# EAGLE design LEDBoard (EAGLE 9.2.2)
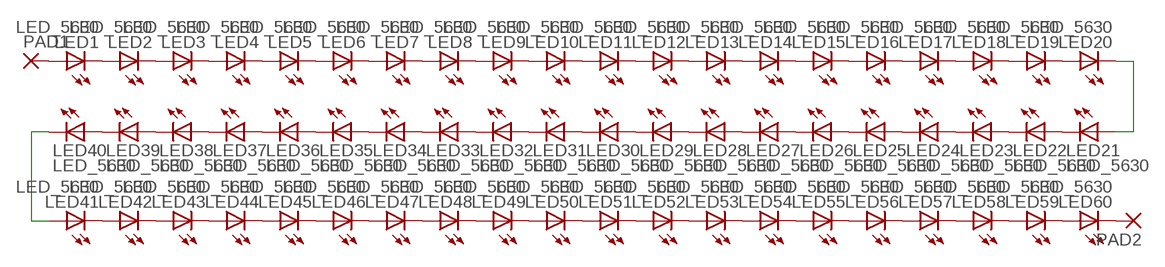
[diagram p0: schematic, sheet 1]

## Parts
LED1  LED_5630  [LED5730]
LED2  LED_5630  [LED5730]
LED3  LED_5630  [LED5730]
LED4  LED_5630  [LED5730]
LED5  LED_5630  [LED5730]
LED6  LED_5630  [LED5730]
LED7  LED_5630  [LED5730]
LED8  LED_5630  [LED5730]
LED9  LED_5630  [LED5730]
LED10  LED_5630  [LED5730]
LED11  LED_5630  [LED5730]
LED12  LED_5630  [LED5730]
LED13  LED_5630  [LED5730]
LED14  LED_5630  [LED5730]
LED15  LED_5630  [LED5730]
LED16  LED_5630  [LED5730]
LED17  LED_5630  [LED5730]
LED18  LED_5630  [LED5730]
LED19  LED_5630  [LED5730]
LED20  LED_5630  [LED5730]
LED21  LED_5630  [LED5730]
LED22  LED_5630  [LED5730]
LED23  LED_5630  [LED5730]
LED24  LED_5630  [LED5730]
LED25  LED_5630  [LED5730]
LED26  LED_5630  [LED5730]
LED27  LED_5630  [LED5730]
LED28  LED_5630  [LED5730]
LED29  LED_5630  [LED5730]
LED30  LED_5630  [LED5730]
LED31  LED_5630  [LED5730]
LED32  LED_5630  [LED5730]
LED33  LED_5630  [LED5730]
LED34  LED_5630  [LED5730]
LED35  LED_5630  [LED5730]
LED36  LED_5630  [LED5730]
LED37  LED_5630  [LED5730]
LED38  LED_5630  [LED5730]
LED39  LED_5630  [LED5730]
LED40  LED_5630  [LED5730]
LED41  LED_5630  [LED5730]
LED42  LED_5630  [LED5730]
LED43  LED_5630  [LED5730]
LED44  LED_5630  [LED5730]
LED45  LED_5630  [LED5730]
LED46  LED_5630  [LED5730]
LED47  LED_5630  [LED5730]
LED48  LED_5630  [LED5730]
LED49  LED_5630  [LED5730]
LED50  LED_5630  [LED5730]
LED51  LED_5630  [LED5730]
LED52  LED_5630  [LED5730]
LED53  LED_5630  [LED5730]
LED54  LED_5630  [LED5730]
LED55  LED_5630  [LED5730]
LED56  LED_5630  [LED5730]
LED57  LED_5630  [LED5730]
LED58  LED_5630  [LED5730]
LED59  LED_5630  [LED5730]
LED60  LED_5630  [LED5730]
PAD1  SMD5  [SMD2,54-5,08]
PAD2  SMD5  [SMD2,54-5,08]

## Nets
N$1: LED1.C LED2.A LED2.A1(A)
N$2: LED3.C LED4.A LED4.A1(A)
N$3: LED2.C LED3.A LED3.A1(A)
N$4: LED5.C LED6.A LED6.A1(A)
N$5: LED7.C LED8.A LED8.A1(A)
N$6: LED6.C LED7.A LED7.A1(A)
N$7: LED4.C LED5.A LED5.A1(A)
N$8: LED9.C LED10.A LED10.A1(A)
N$9: LED11.C LED12.A LED12.A1(A)
N$10: LED10.C LED11.A LED11.A1(A)
N$11: LED13.C LED14.A LED14.A1(A)
N$12: LED15.C LED16.A LED16.A1(A)
N$13: LED14.C LED15.A LED15.A1(A)
N$14: LED12.C LED13.A LED13.A1(A)
N$15: LED8.C LED9.A LED9.A1(A)
N$16: LED17.C LED18.A LED18.A1(A)
N$17: LED19.C LED20.A LED20.A1(A)
N$18: LED18.C LED19.A LED19.A1(A)
N$19: LED16.C LED17.A LED17.A1(A)
N$20: LED21.C LED22.A LED22.A1(A)
N$21: LED23.C LED24.A LED24.A1(A)
N$22: LED22.C LED23.A LED23.A1(A)
N$23: LED25.C LED26.A LED26.A1(A)
N$24: LED27.C LED28.A LED28.A1(A)
N$25: LED26.C LED27.A LED27.A1(A)
N$26: LED24.C LED25.A LED25.A1(A)
N$27: LED29.C LED30.A LED30.A1(A)
N$28: LED31.C LED32.A LED32.A1(A)
N$29: LED30.C LED31.A LED31.A1(A)
N$30: LED33.C LED34.A LED34.A1(A)
N$31: LED35.C LED36.A LED36.A1(A)
N$32: LED34.C LED35.A LED35.A1(A)
N$33: LED32.C LED33.A LED33.A1(A)
N$34: LED28.C LED29.A LED29.A1(A)
N$35: LED37.C LED38.A LED38.A1(A)
N$36: LED39.C LED40.A LED40.A1(A)
N$37: LED38.C LED39.A LED39.A1(A)
N$38: LED36.C LED37.A LED37.A1(A)
N$39: LED41.C LED42.A LED42.A1(A)
N$40: LED43.C LED44.A LED44.A1(A)
N$41: LED42.C LED43.A LED43.A1(A)
N$42: LED45.C LED46.A LED46.A1(A)
N$43: LED47.C LED48.A LED48.A1(A)
N$44: LED46.C LED47.A LED47.A1(A)
N$45: LED44.C LED45.A LED45.A1(A)
N$46: LED49.C LED50.A LED50.A1(A)
N$47: LED51.C LED52.A LED52.A1(A)
N$48: LED50.C LED51.A LED51.A1(A)
N$49: LED53.C LED54.A LED54.A1(A)
N$50: LED55.C LED56.A LED56.A1(A)
N$51: LED54.C LED55.A LED55.A1(A)
N$52: LED52.C LED53.A LED53.A1(A)
N$53: LED48.C LED49.A LED49.A1(A)
N$54: LED57.C LED58.A LED58.A1(A)
N$55: LED59.C LED60.A LED60.A1(A)
N$56: LED58.C LED59.A LED59.A1(A)
N$57: LED56.C LED57.A LED57.A1(A)
N$58: LED20.C LED21.A LED21.A1(A)
N$59: LED40.C LED41.A LED41.A1(A)
N$60: LED1.A LED1.A1(A) PAD1.1(P)
N$61: LED60.C PAD2.1(P)

## Library data of the parts
LED1-LED60 = Flamberm:LED_
PAD1 PAD2 = wirepad:SMD5: SMD PAD

## Board
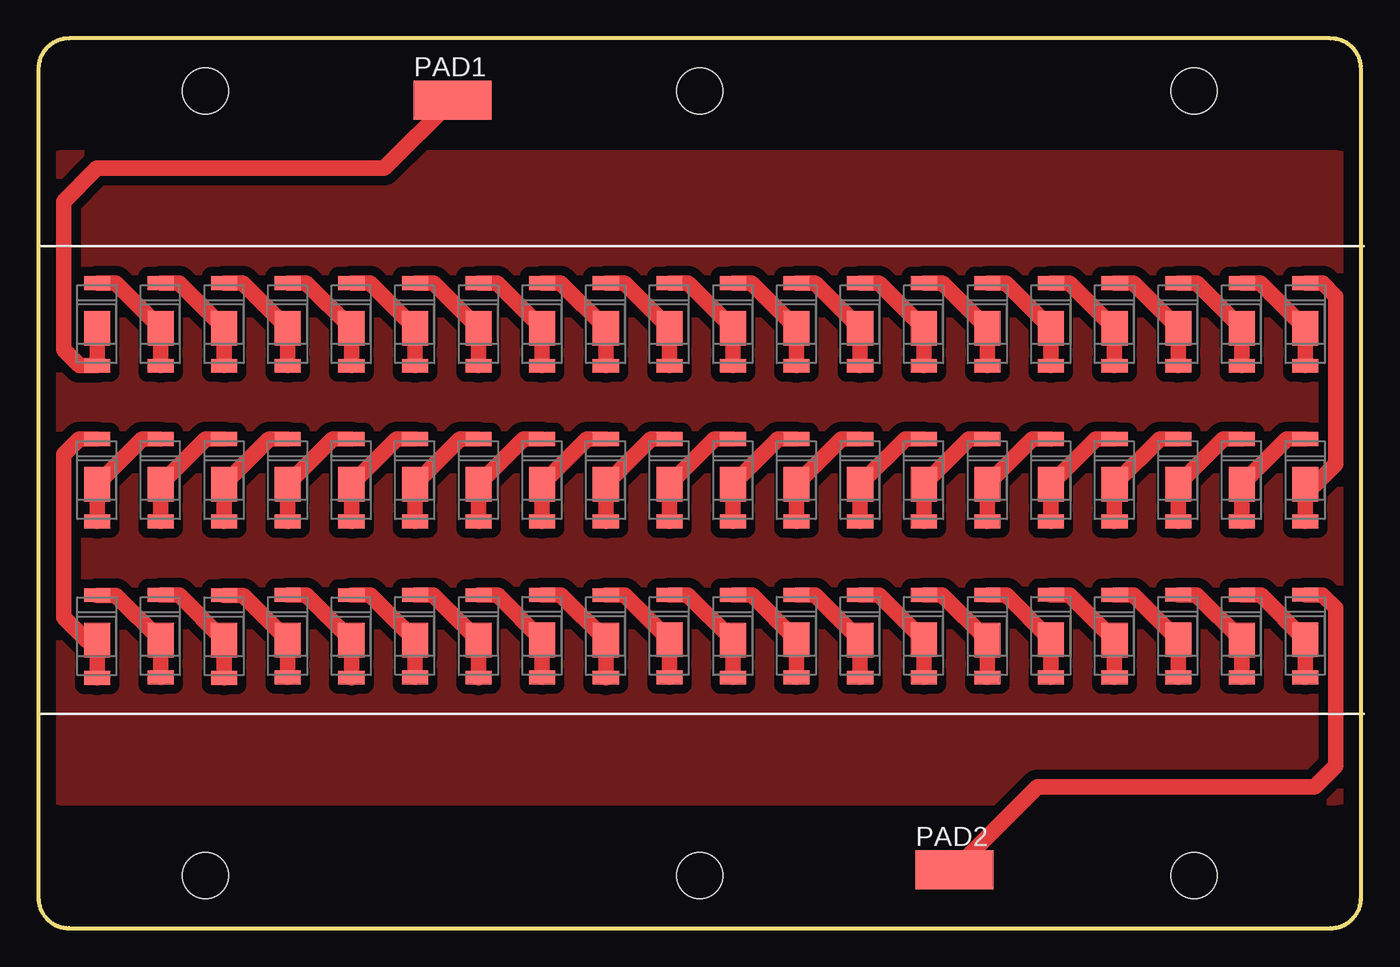
[diagram p1: board, top side]

Size 86.2 x 58 mm. Coordinates in mm from the lower left corner, seen from the top.
Outline: 84.2,0 arc90 86.2,2 86.2,56 arc90 84.2,58 2,58 arc90 0,56 0,2 arc90 2,0 84.2,0
Copper layers (1*16): Top 0.035mm / dielectric 1mm / Bottom 0.035mm
Design rules "default *": minimum track width 6mil, minimum drill 0.35mm, track to track 6mil, track to pad 6mil, pad to pad 6mil, via to via 6mil, smd to smd 6mil, copper to edge 40mil, drill to drill 6mil, minimum pad ring 10mil, minimum via ring 8mil, stop-mask expansion 4mil, vias tented up to drill 0mil, thermal gap 10mil
Holes 3 mm at 10.9,3.42 43.1,3.42 75.3,3.42 43.1,54.58 10.9,54.58 75.3,54.58

### Footprints (pad centres in the part's own frame; a part is rotated, then mirrored left to right if it is on the bottom)
LED5730 = smd 0.9 x 1.7: A -2.708,-0.014; C 2.672,-0.014 | smd 2.25 x 1.7: A1 -0.263,-0.014
SMD2,54-5,08 = smd 2.54 x 5.08: 1 0,0

### Placement (x,y rotation side)
LED1  3.81,39.37 90 top
LED2  7.95,39.37 90 top
LED3  12.1,39.37 90 top
LED4  16.24,39.37 90 top
LED5  20.39,39.37 90 top
LED6  24.53,39.37 90 top
LED7  28.68,39.37 90 top
LED8  32.82,39.37 90 top
LED9  36.96,39.37 90 top
LED10  41.11,39.37 90 top
LED11  45.25,39.37 90 top
LED12  49.4,39.37 90 top
LED13  53.54,39.37 90 top
LED14  57.68,39.37 90 top
LED15  61.83,39.37 90 top
LED16  65.97,39.37 90 top
LED17  70.12,39.37 90 top
LED18  74.26,39.37 90 top
LED19  78.41,39.37 90 top
LED20  82.55,39.37 90 top
LED21  82.55,29.21 90 top
LED22  78.41,29.21 90 top
LED23  74.26,29.21 90 top
LED24  70.12,29.21 90 top
LED25  65.97,29.21 90 top
LED26  61.83,29.21 90 top
LED27  57.68,29.21 90 top
LED28  53.54,29.21 90 top
LED29  49.4,29.21 90 top
LED30  45.25,29.21 90 top
LED31  41.11,29.21 90 top
LED32  36.96,29.21 90 top
LED33  32.82,29.21 90 top
LED34  28.68,29.21 90 top
LED35  24.53,29.21 90 top
LED36  20.39,29.21 90 top
LED37  16.24,29.21 90 top
LED38  12.1,29.21 90 top
LED39  7.95,29.21 90 top
LED40  3.81,29.21 90 top
LED41  3.81,19.03 90 top
LED42  7.95,19.05 90 top
LED43  12.1,19.03 90 top
LED44  16.24,19.05 90 top
LED45  20.39,19.04 90 top
LED46  24.53,19.05 90 top
LED47  28.68,19.04 90 top
LED48  32.82,19.06 90 top
LED49  36.96,19.04 90 top
LED50  41.11,19.06 90 top
LED51  45.25,19.04 90 top
LED52  49.4,19.06 90 top
LED53  53.54,19.04 90 top
LED54  57.68,19.06 90 top
LED55  61.83,19.05 90 top
LED56  65.97,19.06 90 top
LED57  70.12,19.05 90 top
LED58  74.26,19.07 90 top
LED59  78.41,19.05 90 top
LED60  82.55,19.07 90 top
PAD1  26.99,53.98 90 top
PAD2  59.69,3.81 90 top

### Tracks (layer width: path | path; a pad name or v marks a point on that pad's centre or on a via)
GND
  pour Top (isolate 0.61): 8.57,50.48 84.36,50.48 arc-90 86.36,48.48 86.36,12.38 86.36,10.26 arc-90 84.36,8.26 5.71,8.26 1.68,8.26 arc-90 -0.32,10.26 -0.32,39.37 -0.32,48.48 arc-90 1.68,50.48
N$1
  Top 1.016: LED1.C 5.03,42.04 LED2.A1 LED2.A
N$2
  Top 1.016: LED3.C 13.32,42.04 LED4.A1 LED4.A
N$3
  Top 1.016: LED2.C 9.18,42.04 LED3.A1 LED3.A
N$4
  Top 1.016: LED5.C 21.61,42.04 LED6.A1 LED6.A
N$5
  Top 1.016: LED7.C 29.9,42.04 LED8.A1 LED8.A
N$6
  Top 1.016: LED6.C 25.75,42.04 LED7.A1 LED7.A
N$7
  Top 1.016: LED4.C 17.47,42.04 LED5.A1 LED5.A
N$8
  Top 1.016: LED9.C 38.19,42.04 LED10.A1 LED10.A
N$9
  Top 1.016: LED11.C 46.48,42.04 LED12.A1 LED12.A
N$10
  Top 1.016: LED10.C 42.33,42.04 LED11.A1 LED11.A
N$11
  Top 1.016: LED13.C 54.76,42.04 LED14.A1 LED14.A
N$12
  Top 1.016: LED15.C 63.05,42.04 LED16.A1 LED16.A
N$13
  Top 1.016: LED14.C 58.91,42.04 LED15.A1 LED15.A
N$14
  Top 1.016: LED12.C 50.62,42.04 LED13.A1 LED13.A
N$15
  Top 1.016: LED8.C 34.04,42.04 LED9.A1 LED9.A
N$16
  Top 1.016: LED17.C 71.34,42.04 LED18.A1 LED18.A
N$17
  Top 1.016: LED19.C 79.63,42.04 LED20.A1 LED20.A
N$18
  Top 1.016: LED18.C 75.48,42.04 LED19.A1 LED19.A
N$19
  Top 1.016: LED16.C 67.2,42.04 LED17.A1 LED17.A
N$20
  Top 1.016: LED21.C 81.36,31.88 LED22.A1 LED22.A
N$21
  Top 1.016: LED23.C 73.07,31.88 LED24.A1 LED24.A
N$22
  Top 1.016: LED22.C 77.21,31.88 LED23.A1 LED23.A
N$23
  Top 1.016: LED25.C 64.78,31.88 LED26.A1 LED26.A
N$24
  Top 1.016: LED27.C 56.49,31.88 LED28.A1 LED28.A
N$25
  Top 1.016: LED26.C 60.63,31.88 LED27.A1 LED27.A
N$26
  Top 1.016: LED24.C 68.92,31.88 LED25.A1 LED25.A
N$27
  Top 1.016: LED29.C 48.2,31.88 LED30.A1 LED30.A
N$28
  Top 1.016: LED32.A LED32.A1 39.91,31.88 LED31.C
N$29
  Top 1.016: LED30.C 44.06,31.88 LED31.A1 LED31.A
N$30
  Top 1.016: LED33.C 31.62,31.88 LED34.A1 LED34.A
N$31
  Top 1.016: LED35.C 23.34,31.88 LED36.A1 LED36.A
N$32
  Top 1.016: LED34.C 27.48,31.88 LED35.A1 LED35.A
N$33
  Top 1.016: LED32.C 35.77,31.88 LED33.A1 LED33.A
N$34
  Top 1.016: LED28.C 52.34,31.88 LED29.A1 LED29.A
N$35
  Top 1.016: LED37.C 15.05,31.88 LED38.A1 LED38.A
N$36
  Top 1.016: LED39.C 6.76,31.88 LED40.A1 LED40.A
N$37
  Top 1.016: LED38.C 10.9,31.88 LED39.A1 LED39.A
N$38
  Top 1.016: LED36.C 19.19,31.88 LED37.A1 LED37.A
N$39
  Top 1.016: LED41.C 5.05,21.7 LED42.A1 LED42.A
N$40
  Top 1.016: LED43.C 13.34,21.71 LED44.A1 LED44.A
N$41
  Top 1.016: LED42.C 9.16,21.72 LED43.A1 LED43.A
N$42
  Top 1.016: LED45.C 21.63,21.71 LED46.A1 LED46.A
N$43
  Top 1.016: LED47.C 29.91,21.71 LED48.A1 LED48.A
N$44
  Top 1.016: LED46.C 25.74,21.73 LED47.A1 LED47.A
N$45
  Top 1.016: LED44.C 17.45,21.72 LED45.A1 LED45.A
N$46
  Top 1.016: LED49.C 38.2,21.71 LED50.A1 LED50.A
N$47
  Top 1.016: LED51.C 46.49,21.71 LED52.A1 LED52.A
N$48
  Top 1.016: LED50.C 42.32,21.73 LED51.A1 LED51.A
N$49
  Top 1.016: LED53.C 54.78,21.72 LED54.A1 LED54.A
N$50
  Top 1.016: LED55.C 63.07,21.72 LED56.A1 LED56.A
N$51
  Top 1.016: LED54.C 58.89,21.73 LED55.A1 LED55.A
N$52
  Top 1.016: LED52.C 50.6,21.73 LED53.A1 LED53.A
N$53
  Top 1.016: LED48.C 34.03,21.73 LED49.A1 LED49.A
N$54
  Top 1.016: LED57.C 71.36,21.72 LED58.A1 LED58.A
N$55
  Top 1.016: LED59.C 79.65,21.72 LED60.A1 LED60.A
N$56
  Top 1.016: LED58.C 75.47,21.74 LED59.A1 LED59.A
N$57
  Top 1.016: LED56.C 67.18,21.73 LED57.A1 LED57.A
N$58
  Top 1.016: LED20.C 83.69,42.04 84.55,41.18 84.55,30.26 83.19,28.89 83.13,28.95 | 83.13,28.95 LED21.A1 | LED21.A 82.56,28.38 83.13,28.95
N$59
  Top 1.016: LED40.C 2.67,31.88 1.65,30.86 1.65,20.26 3.17,18.73 3.21,18.77 LED41.A1 LED41.A
N$60
  Top 1.016: LED1.A1 LED1.A 2.71,36.66 1.65,37.72 1.65,47.37 3.81,49.53 22.54,49.53 PAD1.1
N$61
  Top 1.016: LED60.C 83.67,21.74 84.55,20.86 84.55,10.57 83.19,9.21 65.09,9.21 PAD2.1